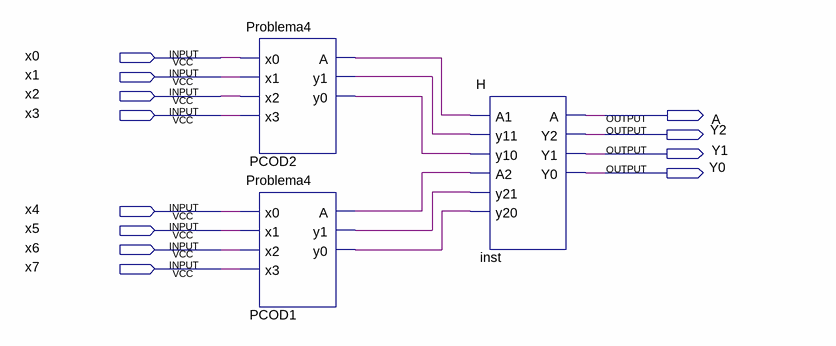
[diagram p0: schematic sheet]
// Quartus schematic Problema5.bdf as structural Verilog: 3 symbols, 12 pins
module Problema5 (
  input  x0,
  input  x1,
  input  x2,
  input  x3,
  input  x4,
  input  x5,
  input  x6,
  input  x7,
  output A,
  output Y2,
  output Y1,
  output Y0
);

  wire PCOD1_a, PCOD1_y0, PCOD1_y1, PCOD2_a, PCOD2_y0, PCOD2_y1;

  Problema4 PCOD2 (.x0(x0), .x1(x1), .x2(x2), .x3(x3), .A(PCOD2_a), .y1(PCOD2_y1), .y0(PCOD2_y0));
  Problema4 PCOD1 (.x0(x4), .x1(x5), .x2(x6), .x3(x7), .A(PCOD1_a), .y1(PCOD1_y1), .y0(PCOD1_y0));
  H inst (
    .A1(PCOD2_a), .y11(PCOD2_y1), .y10(PCOD2_y0), .A2(PCOD1_a), .y21(PCOD1_y1), .y20(PCOD1_y0), .A(A),
    .Y2(Y2), .Y1(Y1), .Y0(Y0));
endmodule
